# EAGLE design DotMatrix (EAGLE 5.11)
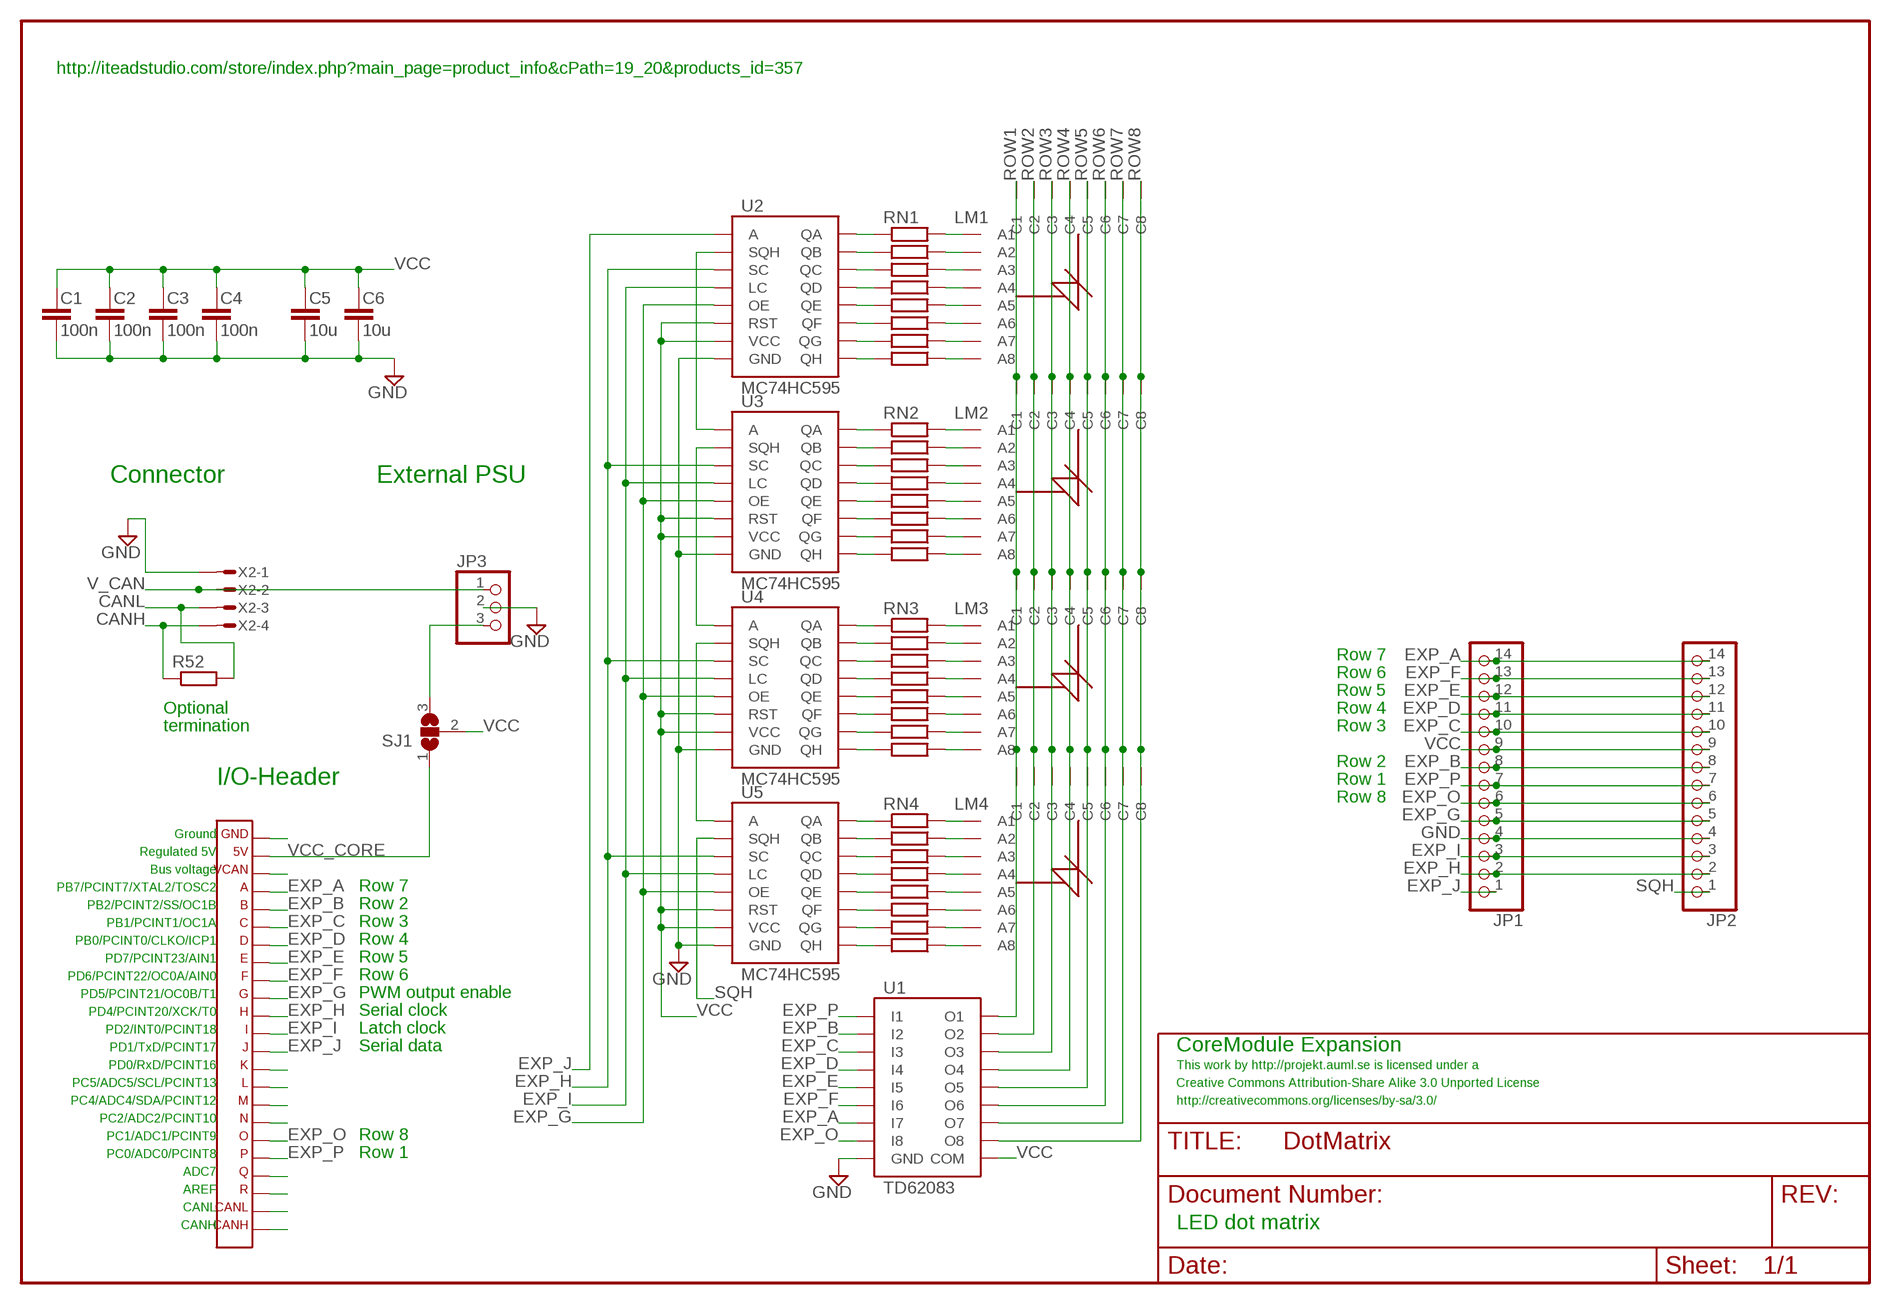
[diagram p0: schematic, sheet 1]

## Parts
C1  100n  C-EUC0603  [C0603]
C2  100n  C-EUC0603  [C0603]
C3  100n  C-EUC0603  [C0603]
C4  100n  C-EUC0603  [C0603]
C5  10u  C-EUC0805  [C0805]
C6  10u  C-EUC0805  [C0805]
JP1  PINHD-1X14SMD  [1X14SMD]
JP2  PINHD-1X14SMD  [1X14SMD]
JP3  PINHD-1X3  [1X03]
LM1  CA8X83MM  [3MM]
LM2  CA8X83MM  [3MM]
LM3  CA8X83MM  [3MM]
LM4  CA8X83MM  [3MM]
R52  R-EUR0603  [R0603]
RN1  R-EU-ARR80402  [R0402X8]
RN2  R-EU-ARR80402  [R0402X8]
RN3  R-EU-ARR80402  [R0402X8]
RN4  R-EU-ARR80402  [R0402X8]
SJ1  SJ_2_NO"  [SJ_2_NO]
U1  TD62083  TD62083SOP18  [SOP18]
U2  MC74HC595  74595  [16-TSSOP]
U3  MC74HC595  74595  [16-TSSOP]
U4  MC74HC595  74595  [16-TSSOP]
U5  MC74HC595  74595  [16-TSSOP]
X1  CORETWO_LAYOUTISPHOLES_CU  [CORETWO_LAYOUT_ISPHOLES_CU]
X2  MICROMATCH-4  [MICROMATCH-4]

## Nets
CANH: R52.1 X1.CANH X2.4
CANL: R52.2 X1.CANL X2.3
EXP_A: JP1.14 JP2.14 U1.7(I7) X1.A
EXP_B: JP1.8 JP2.8 U1.2(I2) X1.B
EXP_C: JP1.10 JP2.10 U1.3(I3) X1.C
EXP_D: JP1.11 JP2.11 U1.4(I4) X1.D
EXP_E: JP1.12 JP2.12 U1.5(I5) X1.E
EXP_F: JP1.13 JP2.13 U1.6(I6) X1.F
EXP_G: JP1.5 JP2.5 U2.13(OE) U3.13(OE) U4.13(OE) U5.13(OE) X1.G
EXP_H: JP1.2 JP2.2 U2.11(SC) U3.11(SC) U4.11(SC) U5.11(SC) X1.H
EXP_I: JP1.3 JP2.3 U2.12(LC) U3.12(LC) U4.12(LC) U5.12(LC) X1.I
EXP_J: JP1.1 U2.14(A) X1.J
EXP_K: X1.K
EXP_L: X1.L
EXP_M: X1.M
EXP_N: X1.N
EXP_O: JP1.6 JP2.6 U1.8(I8) X1.O
EXP_P: JP1.7 JP2.7 U1.1(I1) X1.P
EXP_Q: X1.Q
EXP_R: X1.R
GND: C1.2 C2.2 C3.2 C4.2 C5.2 C6.2 JP1.4 JP2.4 JP3.2 U1.9(GND) U2.8(GND) U3.8(GND) U4.8(GND) U5.8(GND) X1.GND X2.1
N$1: LM1.9(A1) RN1.P$9
N$2: LM1.14(A2) RN1.P$10
N$3: LM1.8(A3) RN1.P$11
N$4: LM1.12(A4) RN1.P$12
N$5: LM1.1(A5) RN1.P$13
N$6: LM1.7(A6) RN1.P$14
N$7: LM1.2(A7) RN1.P$15
N$8: LM1.5(A8) RN1.P$16
N$10: JP3.3 SJ1.3
N$17: LM2.9(A1) RN2.P$9
N$18: LM2.14(A2) RN2.P$10
N$19: LM2.8(A3) RN2.P$11
N$20: LM2.12(A4) RN2.P$12
N$21: LM2.1(A5) RN2.P$13
N$22: LM2.7(A6) RN2.P$14
N$23: LM2.2(A7) RN2.P$15
N$24: LM2.5(A8) RN2.P$16
N$25: LM3.9(A1) RN3.P$9
N$26: LM3.14(A2) RN3.P$10
N$27: LM3.8(A3) RN3.P$11
N$28: LM3.12(A4) RN3.P$12
N$29: LM3.1(A5) RN3.P$13
N$30: LM3.7(A6) RN3.P$14
N$31: LM3.2(A7) RN3.P$15
N$32: LM3.5(A8) RN3.P$16
N$33: LM4.9(A1) RN4.P$9
N$34: LM4.14(A2) RN4.P$10
N$35: LM4.8(A3) RN4.P$11
N$36: LM4.12(A4) RN4.P$12
N$37: LM4.1(A5) RN4.P$13
N$38: LM4.7(A6) RN4.P$14
N$39: LM4.2(A7) RN4.P$15
N$40: LM4.5(A8) RN4.P$16
N$41: RN1.P$2 U2.1(QB)
N$42: RN1.P$3 U2.2(QC)
N$43: RN1.P$4 U2.3(QD)
N$44: RN1.P$5 U2.4(QE)
N$45: RN1.P$6 U2.5(QF)
N$46: RN1.P$7 U2.6(QG)
N$47: RN1.P$8 U2.7(QH)
N$48: RN1.P$1 U2.15(QA)
N$49: RN2.P$2 U3.1(QB)
N$50: RN2.P$3 U3.2(QC)
N$51: RN2.P$4 U3.3(QD)
N$52: RN2.P$5 U3.4(QE)
N$53: RN2.P$6 U3.5(QF)
N$54: RN2.P$7 U3.6(QG)
N$55: RN2.P$8 U3.7(QH)
N$56: RN2.P$1 U3.15(QA)
N$57: RN3.P$2 U4.1(QB)
N$58: RN3.P$3 U4.2(QC)
N$59: RN3.P$4 U4.3(QD)
N$60: RN3.P$5 U4.4(QE)
N$61: RN3.P$6 U4.5(QF)
N$62: RN3.P$7 U4.6(QG)
N$63: RN3.P$8 U4.7(QH)
N$64: RN3.P$1 U4.15(QA)
N$65: RN4.P$2 U5.1(QB)
N$66: RN4.P$3 U5.2(QC)
N$67: RN4.P$4 U5.3(QD)
N$68: RN4.P$5 U5.4(QE)
N$69: RN4.P$6 U5.5(QF)
N$70: RN4.P$7 U5.6(QG)
N$71: RN4.P$8 U5.7(QH)
N$72: RN4.P$1 U5.15(QA)
N$79: U4.9(SQH) U5.14(A)
N$80: U3.9(SQH) U4.14(A)
N$81: U2.9(SQH) U3.14(A)
ROW1: LM1.13(C1) LM2.13(C1) LM3.13(C1) LM4.13(C1) U1.18(O1)
ROW2: LM1.3(C2) LM2.3(C2) LM3.3(C2) LM4.3(C2) U1.17(O2)
ROW3: LM1.4(C3) LM2.4(C3) LM3.4(C3) LM4.4(C3) U1.16(O3)
ROW4: LM1.10(C4) LM2.10(C4) LM3.10(C4) LM4.10(C4) U1.15(O4)
ROW5: LM1.6(C5) LM2.6(C5) LM3.6(C5) LM4.6(C5) U1.14(O5)
ROW6: LM1.11(C6) LM2.11(C6) LM3.11(C6) LM4.11(C6) U1.13(O6)
ROW7: LM1.15(C7) LM2.15(C7) LM3.15(C7) LM4.15(C7) U1.12(O7)
ROW8: LM1.16(C8) LM2.16(C8) LM3.16(C8) LM4.16(C8) U1.11(O8)
SQH: JP2.1 U5.9(SQH)
V_CAN: JP3.1 X1.VCAN X2.2
VCC: C1.1 C2.1 C3.1 C4.1 C5.1 C6.1 JP1.9 JP2.9 SJ1.2 U1.10(COM) U2.10(RST) U2.16(VCC) U3.10(RST) U3.16(VCC) U4.10(RST) U4.16(VCC) U5.10(RST) U5.16(VCC)
VCC_CORE: SJ1.1 X1.5V

## Notes on the sheet
- http://iteadstudio.com/store/index.php?main_page=product_info&cPath=19_20&products_id=357
- Connector | External PSU
- Row 7
- Row 6
- Row 5
- Optional | Row 4
- termination | Row 3
- Row 2
- I/O-Header | Row 1
- Row 8
- Ground
- Regulated 5V
- Bus voltage
- PB7/PCINT7/XTAL2/TOSC2 | Row 7
- PB2/PCINT2/SS/OC1B | Row 2
- PB1/PCINT1/OC1A | Row 3
- PB0/PCINT0/CLKO/ICP1 | Row 4
- PD7/PCINT23/AIN1 | Row 5
- PD6/PCINT22/OC0A/AIN0 | Row 6
- PD5/PCINT21/OC0B/T1 | PWM output enable
- PD4/PCINT20/XCK/T0 | Serial clock
- PD2/INT0/PCINT18 | Latch clock
- PD1/TxD/PCINT17 | Serial data | CoreModule Expansion
- PD0/RxD/PCINT16 | This work by http://projekt.auml.se is licensed under a
- PC5/ADC5/SCL/PCINT13 | Creative Commons Attribution-Share Alike 3.0 Unported License
- PC4/ADC4/SDA/PCINT12 | http://creativecommons.org/licenses/by-sa/3.0/
- PC2/ADC2/PCINT10
- PC1/ADC1/PCINT9 | Row 8
- PC0/ADC0/PCINT8 | Row 1
- ADC7
- AREF
- CANL
- CANH | LED dot matrix

## Library data of the parts
C1-C6 = rcl:C-EU
JP1 JP2 = pinhead-mm:PINHD-1X14
JP3 = pinhead-mm:PINHD-1X3
LM1-LM4 = led-matrix:CA8X8
R52 = rcl:R-EU
RN1-RN4 = rcl:R-EU-ARR8
SJ1 = jumper:SJ_2_NO
U1 = driver_TD62083:TD62083
U2-U5 = 74595:74595
X1 = expboard:CORETWO_LAYOUT
X2 = con-amp-micromatch:MICROMATCH-4: MicroMaTch 4 7-215464-4 / 0-215464-4 Drawing Number C-215464 DDEController.pdf

## Board
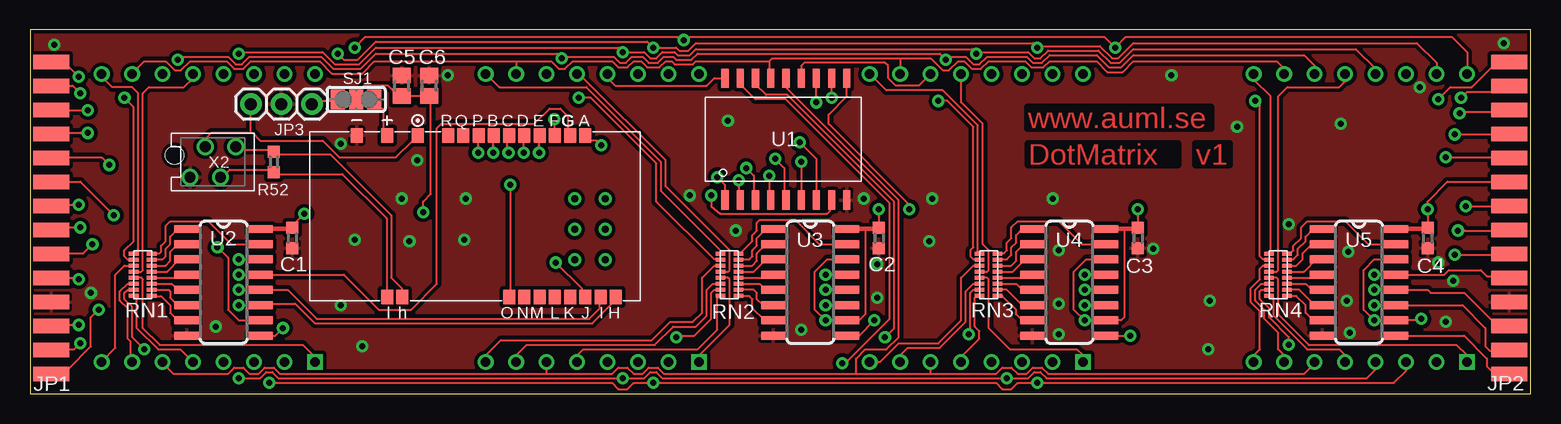
[diagram p1: board, top side]
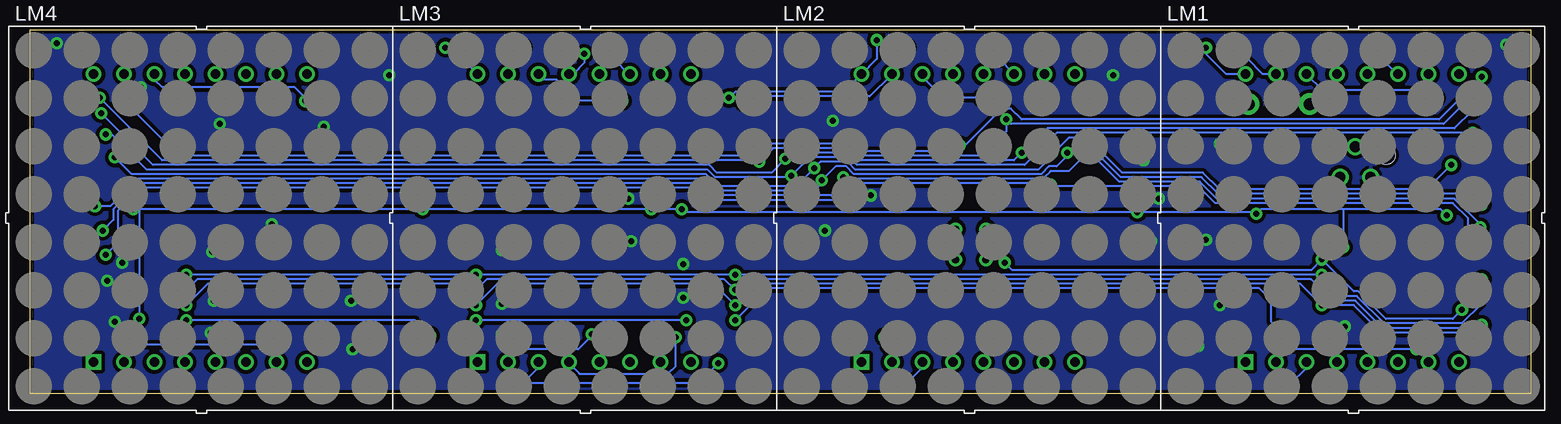
[diagram p2: board, bottom side, seen from below]

Size 125.05 x 30.3 mm. Coordinates in mm from the lower left corner, seen from the top.
Outline: 0,0 125.05,0 125.05,30.3 0,30.3 0,0
Copper layers (1*16): Top 0.035mm / dielectric 1.5mm / Bottom 0.035mm
Design rules "default *": minimum track width 7mil, minimum drill 0.4mm, track to track 7mil, track to pad 7mil, pad to pad 7mil, via to via 7mil, smd to smd 7mil, copper to edge 10mil, drill to drill 8mil, minimum pad ring 10mil, minimum via ring 10mil, stop-mask expansion 4mil, vias tented up to drill 18mil, thermal gap 10mil

### Footprints (pad centres in the part's own frame; a part is rotated, then mirrored left to right if it is on the bottom)
C0603 = smd 1 x 1: 1 -0.85,0; 2 0.85,0
C0805 = smd 1.3 x 1.5: 1 -0.85,0; 2 0.85,0
1X14SMD = smd 1.2 x 3: 1 -13,0; 2 -11,0; 3 -9,0; 4 -7,0; 5 -5,0; 6 -3,0; 7 -1,0; 8 1,0; 9 3,0; 10 5,0; 11 7,0; 12 9,0; 13 11,0; 14 13,0
1X03 = drill 1 pad 1.778 round: 1 -2.54,0; 2 0,0; 3 2.54,0
3MM = drill 0.8 square: 1 0,0 | drill 0.8 round: 2 2.54,0; 3 5.08,0; 4 7.62,0; 5 10.16,0; 6 12.7,0; 7 15.24,0; 8 17.78,0; 9 17.78,24; 10 15.24,24; 11 12.7,24; 12 10.16,24; 13 7.62,24; 14 5.08,24; 15 2.54,24; 16 0,24
R0603 = smd 0.991 x 1.016: 1 -0.85,0; 2 0.85,0
R0402X8 = smd 0.32 x 0.8: P$1 -2.5,1; P$2 -2,1; P$3 -1.5,1; P$4 -1,1; P$5 -0.5,1; P$6 0,1; P$7 0.5,1; P$8 1,1; P$9 -2.5,-0.5; P$10 -2,-0.5; P$11 -1.5,-0.5; P$12 -1,-0.5; P$13 -0.5,-0.5; P$14 0,-0.5; P$15 0.5,-0.5; P$16 1,-0.5
SJ_2_NO = smd 1.168 x 1.6: 1 -1.524,0; 2 0,0; 3 1.524,0
SOP18 = smd 0.6 x 1.6: 1 -5.08,-5.08; 2 -3.81,-5.08; 3 -2.54,-5.08; 4 -1.27,-5.08; 5 0,-5.08; 6 1.27,-5.08; 7 2.54,-5.08; 8 3.81,-5.08; 9 5.08,-5.08; 10 5.08,5.08; 11 3.81,5.08; 12 2.54,5.08; 13 1.27,5.08; 14 0,5.08; 15 -1.27,5.08; 16 -2.54,5.08; 17 -3.81,5.08; 18 -5.08,5.08
16-TSSOP = smd 0.66 x 2.032: 1 -3.302,-3.073; 2 -2.032,-3.073; 3 -0.762,-3.073; 4 0.508,-3.073; 5 1.778,-3.073; 6 3.048,-3.073; 7 4.318,-3.073; 8 5.588,-3.073; 9 5.588,3.073; 10 4.318,3.073; 11 3.048,3.073; 12 1.778,3.073; 13 0.508,3.073; 14 -0.762,3.073; 15 -2.032,3.073; 16 -3.302,3.073
CORETWO_LAYOUT_ISPHOLES_CU = smd 1 x 1.2: 5V 7.315,-6.648; A -9.195,-6.648; B -1.575,-6.648; C -2.845,-6.648; CANH 6.045,6.814; CANL 7.315,6.814; D -4.115,-6.648; E -5.385,-6.648; F -6.655,-6.648; G -7.925,-6.648; GND 9.855,-6.648; H -11.735,6.814; I -10.465,6.814; J -9.195,6.814; K -7.925,6.814; L -6.655,6.814; M -5.385,6.814; N -4.115,6.814; O -2.845,6.814; P -0.305,-6.648; Q 0.965,-6.648; R 2.235,-6.648; VCAN 4.775,-6.648 | drill 0.6 round: P$1 -10.846,3.708; P$2 -8.306,3.708; P$3 -10.846,1.168; P$4 -8.306,1.168; P$5 -8.306,-1.372; P$6 -10.846,-1.372
MICROMATCH-4 = drill 0.9 round: 1 1.905,1.27; 2 0.635,-1.27; 3 -0.635,1.27; 4 -1.905,-1.27 | hole 1.5: 3.199,-0.562

### Placement (x,y rotation side)
C1  21.84,12.95 270 top
C2  70.74,12.95 270 top
C3  92.33,12.95 270 top
C4  116.46,12.95 270 top
C5  30.99,25.65 90 top
C6  33.27,25.65 90 top
JP1  1.75,14.63 90 top
JP2  123.25,14.63 90 top
JP3  20.95,24.13 0 top
LM1  23.75,2.63 0 bottom
LM2  55.75,2.63 0 bottom
LM3  87.75,2.63 0 bottom
LM4  119.75,2.63 0 bottom
R52  20.32,19.3 270 top
RN1  9.14,9.14 270 top
RN2  58.04,9.14 270 top
RN3  79.63,9.14 270 top
RN4  103.76,9.14 270 top
SJ1  27.18,24.51 180 top
U1  62.99,21.21 0 top
U2  16.13,10.41 270 top
U3  65.02,10.41 270 top
U4  86.61,10.41 270 top
U5  110.74,10.41 270 top
X1  37.08,14.86 180 top
X2  15.24,19.3 180 top

### Tracks (layer width: path | path; a pad name or v marks a point on that pad's centre or on a via)
CANH
  Top 0.178: X2.4 17.4,20.32 20.15,20.32 R52.1 20.36,20.15 20.57,19.94 25.02,19.94 30.1,14.86 30.1,9.65 30.99,8.76 30.99,8.1 X1.CANH
CANL
  Top 0.178: X2.3 16,18.03 16.64,18.67 20.11,18.67 R52.2 20.41,18.45 20.57,18.29 26.04,18.29 29.72,14.61 29.72,8.1 X1.CANL
EXP_A  (via drill 0.5)
  Top 0.178: v64.14,20.95 65.53,19.56 U1.7 | v117.35,24.51 118.36,25.53 120.14,25.53 121.79,27.18 122.05,27.18 122.5,27.63 JP2.14 | v47.59,20.7 47.21,21.08 46.61,21.08 46.28,21.41 X1.A | v4.06,26.42 2.85,27.63 JP1.14
  Bottom 0.178: v117.35,24.51 112.65,19.81 65.28,19.81 v64.14,20.95 64.01,20.83 56.39,20.83 55.75,20.19 48.26,20.19 47.75,20.7 v47.59,20.7 47.12,20.7 44.07,23.75 43.31,23.75 42.42,22.86 7.62,22.86 v4.06,26.42
EXP_B  (via drill 0.5)
  Top 0.178: U1.2 59.05,16.26 v59.05,17.78 | v119.63,15.62 122.68,15.62 122.69,15.63 JP2.8 | v38.61,20.07 38.61,20.95 38.66,21.01 X1.B | JP1.8 1.77,15.63 1.78,15.62 1.91,15.75 v4.06,15.75
  Bottom 0.178: v119.63,15.62 118.36,15.62 116.08,17.91 68.83,17.91 67.82,16.89 59.69,16.89 59.05,17.53 v59.05,17.78 57.91,18.92 57.02,18.92 56.39,18.29 40.77,18.29 40.13,18.92 39.5,18.92 38.61,19.81 v38.61,20.07 37.72,20.95 37.08,20.95 34.16,18.03 27.43,18.03 26.04,16.64 6.22,16.64 5.33,15.75 v4.06,15.75
EXP_C  (via drill 0.5)
  Top 0.178: U1.3 60.33,16.26 60.33,18.16 v59.69,18.8 | v117.98,19.68 122.56,19.68 122.61,19.63 JP2.10 | v39.88,20.07 39.75,20.19 39.75,20.95 39.93,21.13 X1.C | v6.6,19.05 5.97,19.68 2.79,19.68 2.74,19.63 JP1.10
  Bottom 0.178: v117.98,19.68 116.59,18.29 68.71,18.29 67.69,17.27 61.21,17.27 v59.69,18.8 59.18,19.3 56.9,19.3 56.26,18.67 41.02,18.67 39.88,19.81 v39.88,20.07 39.75,20.07 38.48,21.34 36.96,21.34 34.04,18.41 27.3,18.41 25.91,17.02 8.64,17.02 v6.6,19.05
EXP_D  (via drill 0.5)
  Top 0.178: U1.4 61.59,16.26 v61.59,18.16 | v118.75,21.59 122.3,21.59 122.34,21.63 JP2.11 | v41.15,20.07 41.15,20.95 41.2,21.01 X1.D | v4.83,21.72 2.54,21.72 2.45,21.63 JP1.11
  Bottom 0.178: v118.75,21.59 118.24,21.59 115.32,18.67 68.58,18.67 67.94,18.03 61.72,18.03 v61.59,18.16 60.07,19.68 56.77,19.68 56.13,19.05 42.16,19.05 v41.15,20.07 39.5,21.72 v4.83,21.72
EXP_E  (via drill 0.5)
  Top 0.178: U1.5 62.87,16.26 62.87,18.8 v62.1,19.56 | v119.13,23.37 119.25,23.5 122.17,23.5 122.31,23.63 JP2.12 | v42.42,20.07 42.42,20.95 42.47,21.01 X1.E | v4.83,23.62 3.05,23.62 3.04,23.63 JP1.12
  Bottom 0.178: v119.13,23.37 114.81,19.05 68.45,19.05 67.82,18.41 63.25,18.41 v62.1,19.56 61.59,20.07 56.64,20.07 56.01,19.43 43.05,19.43 v42.42,20.07 42.29,20.07 40.26,22.1 6.35,22.1 v4.83,23.62
EXP_F  (via drill 0.5)
  Top 0.178: v64.26,19.3 U1.6 | v119.25,24.64 119.76,25.15 121.79,25.15 122.28,25.63 JP2.13 | v43.69,22.86 43.69,22.1 43.74,22.05 X1.F | v4.19,25.02 3.56,25.65 3.17,25.65 2.92,25.4 2.69,25.63 JP1.13
  Bottom 0.178: v119.25,24.64 114.05,19.43 64.39,19.43 v64.26,19.3 63.12,20.45 56.52,20.45 55.88,19.81 45.72,19.81 43.69,21.84 v43.69,22.86 43.31,22.48 7.24,22.48 4.83,24.89 4.32,24.89 v4.19,25.02
EXP_G  (via drill 0.5)
  Top 0.178: v112.01,9.91 U5.13 117.86,9.91 118.24,10.29 120.9,10.29 121.41,9.78 122.68,9.78 122.83,9.63 JP2.5 | v87.88,9.91 U4.13 | v66.29,9.91 U3.13 | X1.G 45.01,21.79 44.83,21.97 44.83,23.11 44.2,23.75 43.31,23.75 42.04,22.48 34.29,22.48 33.91,22.1 33.91,9.14 31.75,6.99 29.08,6.99 26.16,9.91 U2.13 v17.4,9.91 | v4.06,9.53 3.94,9.65 2.79,9.65 2.77,9.63 JP1.5
  Bottom 0.178: v112.01,9.91 v87.88,9.91 v66.29,9.91 v17.4,9.91 15.62,8.13 14.48,8.13 12.19,5.84 5.71,5.84 4.06,7.49 v4.06,9.53
EXP_H  (via drill 0.5)
  Top 0.178: v112.01,7.37 U5.11 119.38,7.37 121.28,5.46 121.28,3.94 121.67,3.56 122.43,3.56 122.5,3.63 JP2.2 | v87.88,7.37 U4.11 | v66.29,7.37 U3.11 | v17.4,7.37 U2.11 19.33,7.49 22.1,7.49 23.75,5.84 46.86,5.84 48.82,7.8 X1.H | v4.19,4.19 3.68,3.68 3.05,3.68 2.99,3.63 JP1.2
  Bottom 0.178: v112.01,7.37 110.24,9.14 89.66,9.14 v87.88,7.37 86.11,9.14 68.07,9.14 v66.29,7.37 64.52,9.14 19.18,9.14 v17.4,7.37 14.73,7.37 12.45,5.08 4.95,5.08 4.19,4.32 v4.19,4.19
EXP_I  (via drill 0.5)
  Top 0.178: v112.01,8.64 U5.12 116.46,8.64 116.71,8.38 119.51,8.38 121.92,5.97 122.17,5.97 122.52,5.63 JP2.3 | v87.88,8.64 U4.12 | v66.29,8.64 U3.12 | v17.4,8.64 U2.12 21.46,8.64 23.88,6.22 46.61,6.22 47.5,7.11 47.5,8 X1.I | v4.06,5.71 2.54,5.71 2.45,5.63 JP1.3
  Bottom 0.178: v112.01,8.64 111.12,9.53 88.77,9.53 v87.88,8.64 87,9.53 67.18,9.53 v66.29,8.64 65.41,9.53 18.29,9.53 v17.4,8.64 16.51,7.75 14.61,7.75 12.32,5.46 4.32,5.46 v4.06,5.71
EXP_J  (via drill 0.5)
  Top 0.178: X1.J 46.28,8.2 45.97,8.51 45.97,8.76 v43.81,10.92 | v17.4,11.18 U2.14 | v5.71,6.99 5.08,6.35 5.08,3.94 3.17,2.03 3.05,2.03 2.64,1.63 JP1.1
  Bottom 0.178: v43.81,10.92 43.18,10.29 18.29,10.29 v17.4,11.18 14.73,8.51 14.35,8.51 12.06,6.22 6.48,6.22 v5.71,6.99
EXP_O  (via drill 0.5)
  Top 0.178: U1.8 66.8,15.62 66.67,15.49 66.67,15.24 66.42,14.99 57.53,14.99 56.77,15.62 v56.77,16.51 | v40.01,17.4 40.01,8.12 X1.O | v118.75,11.56 122.05,11.56 122.12,11.63 JP2.6 | v5.21,12.45 4.45,11.68 3.17,11.68 3.12,11.63 JP1.6
  Bottom 0.178: v118.75,11.56 117.73,12.57 117.73,15.24 115.82,17.14 69.09,17.14 68.07,16.13 57.53,16.13 57.15,16.51 v56.77,16.51 56.77,17.14 56.39,17.53 40.13,17.53 v40.01,17.4 39.88,17.27 27.69,17.27 26.29,15.88 6.48,15.88 5.21,14.61 v5.21,12.45
EXP_P  (via drill 0.5)
  Top 0.178: U1.1 57.91,17.4 v57.28,18.03 | v119,13.59 122.43,13.59 122.47,13.63 JP2.7 | v37.34,20.07 37.34,20.95 37.39,21.01 X1.P | JP1.7 2.71,13.63 2.92,13.84 v4.19,13.84
  Bottom 0.178: 37.34,19.68 v37.34,20.07 | 37.34,19.68 38.48,18.54 40.01,18.54 40.64,17.91 57.15,17.91 v57.28,18.03 57.28,17.53 58.29,16.51 67.94,16.51 68.96,17.53 115.95,17.53 118.11,15.37 118.11,14.48 v119,13.59 | 37.34,19.68 36.32,19.68 34.29,17.65 27.56,17.65 26.16,16.26 6.35,16.26 4.19,14.1 v4.19,13.84
GND  (via drill 0.5)
  other vias: 15.49,5.59 5.08,8.38 27.69,3.94 27.05,12.83 31.62,12.7 30.99,16.26 36.32,16.26 36.2,12.83 75.18,16.26 74.93,12.7 85.22,16.26 64.26,5.33 58.8,13.59 54.99,16.51 58.17,22.73 69.47,16.26 95.12,26.54 93.6,12.06 98.3,7.75 98.17,3.68 109.73,7.75 109.86,11.81 109.98,5.08 117.98,5.97 115.82,25.53 122.81,29.21 118.62,9.4 104.9,14.1 70.61,8 70.61,10.79 2.03,29.08 25.91,7.37 85.72,7.49 85.72,11.94 85.72,4.95 117.35,10.92 100.58,22.23 109.22,22.48 32.26,19.43 34.8,26.54 25.91,20.83
  pour Bottom (isolate 0.305, rank 3): 0,30.3 125.05,30.3 125.05,0 0,0
  pour Top (isolate 0.305, rank 3): 0,30.3 125.05,30.3 125.05,0 0,0
N$1
  Top 0.178: RN1.P$9 8.85,11.64 8.89,11.68 8.89,11.81 9.02,11.94 9.02,25.02 8.51,25.53 6.86,25.53 5.97,26.41 LM1.9
N$2  (via drill 0.5)
  Top 0.178: RN1.P$10 8.16,11.14 7.87,11.43 7.87,11.94 8.64,12.7 8.64,23.88 v7.87,24.64
  Bottom 0.178: v7.87,24.64 8.51,25.27 17.32,25.27 LM1.14
N$3
  Top 0.178: LM1.8 5.97,2.67 7.11,3.81 7.11,9.91 7.87,10.67 8.62,10.67 RN1.P$11
N$4
  Top 0.178: RN1.P$12 8.87,10.14 8.89,10.16 9.27,10.16 9.4,10.29 9.4,25.02 9.91,25.53 12.83,25.53 13.59,26.29 LM1.12
N$5
  Top 0.178: RN1.P$13 8.88,9.64 8.89,9.65 9.27,9.65 9.4,9.53 9.4,5.46 10.79,4.06 22.73,4.06 23.62,3.17 23.62,2.76 LM1.1
N$6
  Top 0.178: LM1.7 8.51,2.92 8.38,3.05 8.38,4.32 8.13,4.57 8.13,7.11 7.49,7.75 7.49,8.51 8.13,9.14 RN1.P$14
N$7  (via drill 0.5)
  Top 0.178: RN1.P$15 8.39,8.64 8.38,8.64 8.13,8.64 7.87,8.38 7.87,7.87 8.51,7.24 8.51,4.7 v9.53,3.68
  Bottom 0.178: v9.53,3.68 20.16,3.68 LM1.2
N$8
  Top 0.178: LM1.5 12.54,3.68 10.67,3.68 8.89,5.46 8.89,8.14 RN1.P$16
N$10
  Top 0.178: JP3.3 23.75,24.38 25.15,24.38 25.27,24.51 SJ1.3
N$17
  Top 0.178: RN2.P$9 57.32,11.64 57.28,11.68 57.78,11.68 52.58,16.89 52.58,19.3 46.35,25.53 39.12,25.53 38.02,26.63 LM2.9
N$18  (via drill 0.5)
  Top 0.178: RN2.P$10 57.31,11.14 57.28,11.18 57.02,11.18 52.2,16 52.2,19.18 46.74,24.64 v45.72,24.64
  Bottom 0.178: LM2.14 50.67,26.42 48.9,24.64 v45.72,24.64
N$19
  Top 0.178: RN2.P$11 57.3,10.64 57.28,10.67 57.02,10.67 56.01,9.65 56.01,6.73 55.24,5.97 53.34,5.97 51.82,4.45 39.24,4.45 37.97,3.17 LM2.8
N$20
  Top 0.178: RN2.P$12 57.77,10.14 57.78,10.16 58.17,10.16 58.29,10.29 58.29,11.94 52.96,17.27 52.96,19.43 46.1,26.29 45.93,26.29 LM2.12
N$21
  Top 0.178: RN2.P$13 57.78,9.64 57.78,9.65 58.17,9.65 58.29,9.53 58.29,5.71 55.75,3.17 LM2.1
N$22
  Top 0.178: RN2.P$14 56.9,9.14 56.39,8.64 56.39,6.48 55.5,5.59 53.59,5.59 52.07,4.06 41.4,4.06 40.51,3.17 LM2.7
N$23  (via drill 0.5)
  Top 0.178: RN2.P$15 57.28,8.64 57.02,8.64 56.77,8.38 56.77,6.22 55.37,4.83 53.98,4.83 v53.85,4.7
  Bottom 0.178: v53.85,4.7 53.85,3.81 53.21,3.17 LM2.2
N$24
  Top 0.178: RN2.P$16 57.29,8.14 57.28,8.13 57.28,5.33 55.63,3.68 46.1,3.68 45.59,3.17 LM2.5
N$25
  Top 0.178: RN3.P$9 79.03,11.64 78.99,11.68 78.99,22.35 76.07,25.27 71.37,25.27 70.36,26.29 70.31,26.29 LM3.9
N$26  (via drill 0.5)
  Top 0.178: RN3.P$10 78.9,11.14 78.87,11.18 78.61,11.18 78.36,11.43 78.36,11.94 78.61,12.19 78.61,22.23 76.45,24.38 v75.69,24.38
  Bottom 0.178: v75.69,24.38 79.38,24.38 81.15,26.16 82.42,26.16 LM3.14
N$27
  Top 0.178: RN3.P$11 78.89,10.64 78.87,10.67 78.61,10.67 77.6,9.65 77.6,6.1 75.69,4.19 72.39,4.19 70.87,2.67 70.1,2.67 LM3.8
N$28
  Top 0.178: RN3.P$12 79.36,10.14 79.38,10.16 79.76,10.16 79.88,10.29 79.88,11.94 79.38,12.45 79.38,22.48 77.6,24.26 LM3.12
N$29
  Top 0.178: RN3.P$13 79.37,9.64 79.38,9.65 79.76,9.65 79.88,9.53 79.88,5.46 81.66,3.68 87.25,3.68 87.76,3.17 LM3.1
N$30
  Top 0.178: RN3.P$14 78.61,9.14 77.98,8.51 77.98,5.97 75.82,3.81 73.15,3.81 72.52,3.17 LM3.7
N$31  (via drill 0.5)
  Top 0.178: RN3.P$15 78.88,8.64 78.87,8.64 78.61,8.64 78.36,8.38 78.36,5.08 v78.23,4.95
  Bottom 0.178: v78.23,4.95 78.23,4.83 79.38,3.68 84.16,3.68 LM3.2
N$32
  Top 0.178: RN3.P$16 79.01,8.14 78.87,8.13 78.74,8 78.74,5.59 79.12,5.21 79.12,4.57 77.6,3.05 LM3.5
N$33
  Top 0.178: RN4.P$9 103.34,11.64 103.38,11.68 103.38,24.77 101.98,26.16 LM4.9
N$34  (via drill 0.5)
  Top 0.178: RN4.P$10 103.03,11.14 103,11.18 102.74,11.18 102.49,11.43 102.49,24 v102.11,24.38
  Bottom 0.178: v102.11,24.38 102.11,24.64 103,25.53 114.05,25.53 114.68,26.16 LM4.14
N$35
  Top 0.178: RN4.P$11 103.02,10.64 103,10.67 102.74,10.67 102.49,10.41 102.49,9.53 101.73,8.76 101.73,7.62 102.49,6.86 102.49,3.68 101.98,3.17 LM4.8
N$36
  Top 0.178: RN4.P$12 103.49,10.14 103.5,10.16 103.89,10.16 104.01,10.29 104.01,24.77 104.78,25.53 109.09,25.53 109.6,26.04 LM4.12
N$37
  Top 0.178: RN4.P$13 103.5,9.64 103.5,9.65 103.89,9.65 104.01,9.53 104.01,6.6 106.55,4.06 118.87,4.06 119.76,3.17 LM4.1
N$38
  Top 0.178: RN4.P$14 102.62,9.14 102.11,8.64 102.11,7.75 102.87,6.99 102.87,6.22 104.01,5.08 104.01,3.68 104.52,3.17 104.52,2.63 LM4.7
N$39  (via drill 0.5)
  Top 0.178: RN4.P$15 103,8.64 102.62,8.64 102.49,8.51 102.49,7.87 103.25,7.11 103.25,6.35 104.9,4.7 v104.9,4.06
  Bottom 0.178: v104.9,4.06 116.33,4.06 117.22,3.17 117.22,2.63 LM4.2
N$40
  Top 0.178: RN4.P$16 103.49,8.14 103.63,8 103.63,6.48 106.43,3.68 109.09,3.68 109.6,3.17 LM4.5
N$41
  Top 0.178: RN1.P$2 10.18,11.18 11.05,11.18 11.3,11.43 11.3,12.06 11.68,12.45 11.68,13.08 12.32,13.72 U2.1
N$42
  Top 0.178: RN1.P$3 10.17,10.67 11.3,10.67 11.68,11.05 11.68,11.81 12.32,12.45 U2.2
N$43
  Top 0.178: RN1.P$4 10.16,10.16 11.43,10.16 12.45,11.18 U2.3
N$44
  Top 0.178: RN1.P$5 10.15,9.65 12.06,9.65 12.32,9.91 U2.4
N$45
  Top 0.178: RN1.P$6 11.81,9.14 12.32,8.64 U2.5
N$46
  Top 0.178: RN1.P$7 10.15,8.64 11.56,8.64 11.68,8.51 11.68,8 12.32,7.37 U2.6
N$47
  Top 0.178: RN1.P$8 10.16,8.13 10.92,8.13 11.68,7.37 11.68,6.73 12.32,6.1 U2.7
N$48
  Top 0.178: RN1.P$1 10.18,11.68 10.79,11.68 10.92,11.81 10.92,12.32 11.3,12.7 11.3,13.97 11.68,14.35 14.86,14.35 16.76,12.45 U2.15
N$49
  Top 0.178: RN2.P$2 59.07,11.18 59.94,11.18 60.2,11.43 60.2,11.94 60.58,12.32 60.58,12.95 61.34,13.72 U3.1
N$50
  Top 0.178: RN2.P$3 59.06,10.67 60.2,10.67 60.58,11.05 60.58,11.68 61.34,12.45 U3.2
N$51
  Top 0.178: RN2.P$4 59.05,10.16 60.33,10.16 61.34,11.18 U3.3
N$52
  Top 0.178: RN2.P$5 59.05,9.65 61.34,9.65 61.59,9.91 U3.4
N$53
  Top 0.178: RN2.P$6 60.83,9.14 61.34,8.64 U3.5
N$54
  Top 0.178: RN2.P$7 60.33,8.64 60.58,8.38 60.58,7.87 61.09,7.37 U3.6
N$55
  Top 0.178: RN2.P$8 59.05,8.13 59.94,8.13 60.2,7.87 60.2,7.11 61.21,6.1 U3.7
N$56
  Top 0.178: RN2.P$1 59.08,11.68 59.18,11.68 60.2,12.7 60.2,13.21 60.58,13.59 60.58,14.22 60.83,14.48 63.75,14.48 65.79,12.45 U3.15
N$57
  Top 0.178: RN3.P$2 80.66,11.18 81.41,11.18 81.79,11.56 81.79,12.19 82.17,12.57 82.17,13.21 82.68,13.72 U4.1
N$58
  Top 0.178: RN3.P$3 80.65,10.67 81.79,10.67 82.17,11.05 82.17,11.81 82.8,12.45 U4.2
N$59
  Top 0.178: RN3.P$4 80.64,10.16 81.92,10.16 82.93,11.18 U4.3
N$60
  Top 0.178: RN3.P$5 80.64,9.65 82.68,9.65 82.93,9.91 U4.4
N$61
  Top 0.178: RN3.P$6 82.17,9.14 82.68,8.64 U4.5
N$62
  Top 0.178: RN3.P$7 81.41,8.64 82.68,7.37 U4.6
N$63
  Top 0.178: RN3.P$8 80.64,8.13 81.03,8.13 82.17,6.99 82.17,6.6 82.68,6.1 U4.7
N$64
  Top 0.178: RN3.P$1 80.67,11.68 81.15,11.68 81.41,11.94 81.41,12.57 81.79,12.95 81.79,13.84 82.3,14.35 85.72,14.35 87.63,12.45 U4.15
N$65
  Top 0.178: RN4.P$2 104.79,11.18 105.28,11.18 105.66,11.56 105.66,12.06 106.3,12.7 106.3,13.08 106.93,13.72 U5.1
N$66
  Top 0.178: RN4.P$3 104.78,10.67 105.54,10.67 106.05,11.18 106.05,11.68 106.81,12.45 U5.2
N$67
  Top 0.178: RN4.P$4 104.78,10.16 106.17,10.16 107.19,11.18 U5.3
N$68
  Top 0.178: RN4.P$5 104.77,9.65 106.68,9.65 106.93,9.91 U5.4
N$69
  Top 0.178: RN4.P$6 106.3,9.14 106.81,8.64 U5.5
N$70
  Top 0.178: RN4.P$7 105.79,8.64 107.06,7.37 U5.6
N$71
  Top 0.178: RN4.P$8 104.78,8.13 105.54,8.13 106.3,7.37 106.3,6.73 106.93,6.1 U5.7
N$72
  Top 0.178: RN4.P$1 104.8,11.68 105.03,11.68 105.28,11.94 105.28,12.32 105.92,12.95 105.92,13.84 106.43,14.35 109.6,14.35 111.51,12.45 U5.15
N$79  (via drill 0.5)
  Top 0.178: U5.14 112.01,11.18 111.12,10.29 111.12,6.99 v112.01,6.1 | U4.9 v91.69,4.83
  Bottom 0.178: v112.01,6.1 92.96,6.1 v91.69,4.83
N$80  (via drill 0.5)
  Top 0.178: U4.14 88.01,11.18 87,10.16 87,6.99 v87.88,6.1 | v70.36,6.1 69.09,4.83 U3.9
  Bottom 0.178: v70.36,6.1 v87.88,6.1
N$81  (via drill 0.5)
  Top 0.178: U3.14 66.42,11.18 65.41,10.16 65.41,6.99 v66.29,6.1 | v21.08,5.46 20.45,4.83 U2.9
  Bottom 0.178: v66.29,6.1 63.63,8.76 22.61,8.76 21.59,7.75 21.59,5.97 v21.08,5.46
ROW1  (via drill 0.5)
  Top 0.178: U1.18 57.02,26.29 56.39,25.65 48.77,25.65 48.26,26.16 48.26,26.5 LM2.13 | 17.27,28.32 v17.4,28.32 17.53,28.45 24.38,28.45 25.4,27.43 27.43,27.43 28.83,28.83 49.02,28.83 v49.4,28.45 51.18,28.45 51.69,27.94 52.2,27.94 52.7,28.45 53.72,28.45 53.98,28.19 54.99,28.19 55.5,28.7 78.49,28.7 v78.87,28.32 78.99,28.45 83.19,28.45 83.69,27.94 84.2,27.94 84.84,28.57 89.03,28.57 90.04,27.56 90.81,27.56 91.95,28.7 110.49,28.7 112.13,27.06 LM4.13
  Bottom 0.178: LM1.13 16.13,27.06 v17.4,28.32 | v49.4,28.45 48.26,27.3 48.26,26.75 LM2.13 | LM3.13 79.8,26.63 78.87,27.56 v78.87,28.32
ROW2  (via drill 0.5)
  Top 0.178: v19.94,0.89 48.51,0.89 49.02,0.38 49.78,0.38 50.29,0.89 v51.94,0.89 80.52,0.89 81.03,0.38 81.79,0.38 82.3,0.89 v83.95,0.89 113.67,0.89 114.68,1.91 114.68,2.03 114.67,2.04 LM4.3 | U1.17 59.18,25.78 60.45,24.51 62.99,24.51 71.63,15.88 71.63,6.22 67.94,2.54 v67.69,2.54
  Bottom 0.178: LM1.3 18.84,2.37 18.8,2.03 v19.94,0.89 | LM2.3 50.67,2.16 v51.94,0.89 | LM3.3 82.67,2.16 v83.95,0.89 82.3,0.89 81.79,0.38 81.03,0.38 80.52,0.89 69.34,0.89 v67.69,2.54
ROW3  (via drill 0.5)
  Top 0.178: v17.4,1.27 19.18,1.27 19.68,1.78 20.19,1.78 20.7,1.27 v49.4,1.27 51.18,1.27 51.69,1.78 52.2,1.78 52.7,1.27 v81.41,1.27 83.19,1.27 83.69,1.78 84.2,1.78 84.71,1.27 111.38,1.27 112.14,2.03 112.13,2.04 LM4.4 | U1.16 60.45,25.78 61.34,24.89 63.12,24.89 72.01,16 72.01,5.46 v71.25,4.7
  Bottom 0.178: LM1.4 16.13,2.54 16.26,2.41 v17.4,1.27 | LM2.4 48.13,2.54 v49.4,1.27 | LM3.4 80.13,2.54 80.14,2.54 | v81.41,1.27 80.14,2.54 | v71.25,4.7 71.25,2.29 71.88,1.65 79.25,1.65 80.14,2.54
ROW4
  Top 0.178: 61.59,27.69 55.5,27.69 55.24,27.43 53.72,27.43 53.47,27.69 52.96,27.69 52.45,27.18 51.44,27.18 50.93,27.69 50.29,27.69 49.78,27.18 49.02,27.18 48.51,27.69 45.21,27.69 44.58,27.05 44.07,27.05 43.43,27.69 40.51,27.69 | 61.59,27.69 61.85,27.94 72.52,27.94 | U1.15 61.59,26.42 61.59,27.69 | LM3.10 72.51,27.94 72.52,27.94 | 72.52,27.94 75.06,27.94 76.07,26.92 76.58,26.92 77.34,27.69 77.85,27.69 78.49,27.05 79.25,27.05 79.88,27.69 82.93,27.69 83.44,27.18 84.45,27.18 84.96,27.69 88.9,27.69 89.79,26.8 91.06,26.8 91.95,27.69 103.89,27.69 104.51,27.06 LM4.10 | 40.51,27.69 28.7,27.69 27.69,26.67 25.15,26.67 24.13,27.69 18.41,27.69 17.78,27.05 17.02,27.05 16.38,27.69 13.34,27.69 12.57,26.92 12.06,26.92 11.3,27.69 9.53,27.69 LM1.10 | LM2.10 40.51,27.68 40.51,27.69
ROW5
  Top 0.178: 43.05,1.65 48.51,1.65 49.02,2.16 49.78,2.16 50.29,1.65 51.05,1.65 51.56,2.16 52.32,2.16 52.83,1.65 68.83,1.65 | 68.83,1.65 75.06,1.65 | 75.06,1.65 80.52,1.65 81.03,2.16 81.79,2.16 82.3,1.65 83.06,1.65 83.57,2.16 84.33,2.16 84.84,1.65 106.17,1.65 107.05,2.53 LM4.6 | LM3.6 75.05,1.65 75.06,1.65 | LM2.6 43.05,1.65 | 43.05,1.65 20.83,1.65 20.32,2.16 19.56,2.16 19.05,1.65 18.29,1.65 17.78,2.16 17.02,2.16 16.51,1.65 11.94,1.65 11.05,2.54 LM1.6 | U1.14 62.99,25.78 63.12,25.65 63.12,25.4 72.39,16.13 72.39,4.7 71.37,3.68 69.6,3.68 68.83,2.92 68.83,1.65
ROW6  (via drill 0.5)
  Top 0.178: U1.13 64.26,27.3 64.52,27.56 71.25,27.56 71.5,27.3 71.5,26.29 72.14,25.65 74.08,25.65 LM3.11 | 12.19,27.81 v12.32,27.81 12.57,28.07 16.51,28.07 17.14,27.43 17.65,27.43 18.29,28.07 24.26,28.07 25.27,27.05 27.56,27.05 28.83,28.32 43.94,28.32 v44.32,27.94 44.45,28.07 48.64,28.07 49.15,27.56 49.66,27.56 50.16,28.07 51.05,28.07 51.56,27.56 52.32,27.56 52.83,28.07 53.59,28.07 53.85,27.81 55.12,27.81 55.63,28.32 75.82,28.32 v76.33,27.81 76.58,28.07 77.98,28.07 78.61,27.43 79.12,27.43 79.76,28.07 83.06,28.07 83.57,27.56 84.33,27.56 84.96,28.19 88.9,28.19 89.92,27.18 90.93,27.18 91.95,28.19 106.17,28.19 107.05,27.31 LM4.11
  Bottom 0.178: LM2.11 43.05,26.67 v44.32,27.94 | LM1.11 11.18,26.68 v12.32,27.81 | LM3.11 75.18,26.67 v76.33,27.81
ROW7  (via drill 0.5)
  Top 0.178: v25.65,28.32 26.16,27.81 27.3,27.81 28.83,29.34 51.44,29.34 v51.94,28.83 53.85,28.83 54.1,28.57 54.86,28.57 55.5,29.21 83.57,29.21 v83.95,28.83 84.2,28.83 84.33,28.96 89.15,28.96 90.17,27.94 90.68,27.94 91.95,29.21 115.57,29.21 117.21,27.57 LM4.15 | v65.53,24.26 U1.12
  Bottom 0.178: LM1.15 22.31,26.63 23.62,27.94 25.27,27.94 v25.65,28.32 | v51.94,28.83 51.94,27.9 LM2.15 55.08,24.77 65.28,24.77 65.53,24.51 v65.53,24.26 | v83.95,28.83 83.95,27.89 LM3.15
ROW8  (via drill 0.5)
  Top 0.178: v27.05,28.83 27.94,29.72 54.23,29.72 v54.48,29.46 54.74,29.72 89.53,29.72 v90.42,28.83 91.31,29.72 118.49,29.72 119.76,28.45 119.76,27.18 119.75,27.17 LM4.16 | v66.8,24.64 U1.11
  Bottom 0.178: LM1.16 25.36,26.63 27.05,28.32 v27.05,28.83 | v54.48,29.46 54.48,27.9 LM2.16 55.8,26.63 57.28,25.15 66.29,25.15 v66.8,24.64 | v90.42,28.83 89.95,28.83 LM3.16
SQH
  Top 0.178: U5.9 119.51,4.83 121.41,2.92 121.41,2.29 122.07,1.63 JP2.1
V_CAN
  Top 0.178: X1.VCAN 32.31,21.39 32,21.08 31.88,21.08 30.48,19.68 25.78,19.68 24.38,21.08 19.18,21.08 18.54,21.72 18.41,21.72 | 18.41,21.72 15.11,21.72 14.61,21.21 X2.2 | 18.41,21.72 JP3.1
VCC  (via drill 0.5)
  Top 0.178: U3.10 69.09,6.1 69.6,6.6 69.6,13.72 | U4.10 90.93,6.1 91.19,6.35 91.19,13.59 91.31,13.72 | 116.46,13.72 v116.46,15.37 116.46,16 118.11,17.65 123.23,17.65 JP2.9 | v70.74,15.37 C2.1 | v92.33,15.37 C3.1 | U5.10 115.82,6.1 v115.95,6.22 | JP1.9 1.78,17.65 4.19,17.65 v6.99,14.86 | 30.82,24.8 30.86,24.77 33.27,24.77 | 33.27,24.77 C6.1 | U2.10 17.4,6.1 16.51,6.99 16.51,11.3 v15.62,12.19 | v32.77,15.11 32.77,16 33.4,16.64 33.4,24.77 33.27,24.77 | v22.86,14.99 21.84,13.97 C1.1 | SJ1.2 27.3,24.64 27.3,25.15 27.81,25.65 29.84,25.65 30.7,24.8 30.82,24.8 | 30.82,24.8 C5.1 | v73.28,15.37 73.28,15.75 66.55,22.48 66.55,23.24 68.07,24.77 U1.10 68.07,26.16
  Top 0.356: U2.16 21.84,13.72 C1.1 | U3.16 69.6,13.72 70.74,13.72 C2.1 | U4.16 91.31,13.72 92.33,13.72 C3.1 | U5.16 116.46,13.72 C4.1
  Bottom 0.178: 115.95,15.37 v92.33,15.37 v73.28,15.37 v70.74,15.37 70.48,15.37 70.23,15.11 v32.77,15.11 22.99,15.11 v22.86,14.99 22.48,15.37 15.62,15.37 | 115.95,15.37 v116.46,15.37 | 15.62,15.37 7.49,15.37 v6.99,14.86 | 115.95,15.37 v115.95,6.22 | 15.62,15.37 v15.62,12.19
VCC_CORE
  Top 0.178: SJ1.1 29.08,24.13 29.08,24 29.46,23.62 29.46,21.97 29.77,21.67 X1.5V

### Text on the board
Top: www.auml.se | DotMatrix | v1
Document: Creative Commons Attribution-Share Alike 3.0 Unported License | This work by http://projekt.auml.se is licensed under a | http://creativecommons.org/licenses/by-sa/3.0/